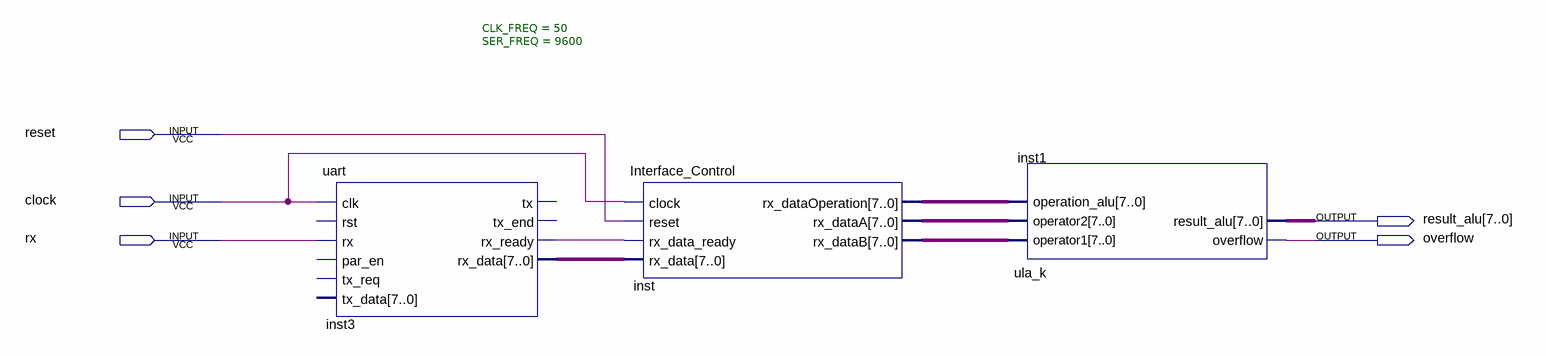
[diagram p0: schematic sheet]
// Quartus schematic Main.bdf as structural Verilog: 3 symbols, 5 pins
module Main (
  input  reset,
  input  clock,
  input  rx,
  output [7:0] result_alu,
  output overflow
);

  wire inst3_rx_ready;
  wire [7:0] inst3_rx_data, inst_rx_dataa, inst_rx_datab, inst_rx_dataoperation;

  uart #(.CLK_FREQ(50), .SER_FREQ(9600)) inst3 (
    .clk(clock), .rx(rx), .rx_ready(inst3_rx_ready), .rx_data(inst3_rx_data));  // open: rst, par_en, tx_req, tx_data, tx, tx_end
  Interface_Control inst (
    .clock(clock), .reset(reset), .rx_data_ready(inst3_rx_ready), .rx_data(inst3_rx_data),
    .rx_dataOperation(inst_rx_dataoperation), .rx_dataA(inst_rx_dataa), .rx_dataB(inst_rx_datab));
  ula_k inst1 (
    .operator1(inst_rx_datab), .operator2(inst_rx_dataa), .operation_alu(inst_rx_dataoperation),
    .overflow(overflow), .result_alu(result_alu));
endmodule
